# Altium schematic sheet panel_board.SchDoc
size A4
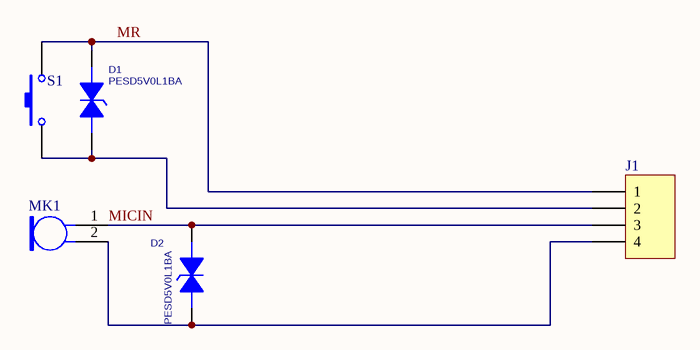
[diagram p0: panel_board.SchDoc]

## Parts
D1  PESD5V0L1BA  [SOD323]
D2  PESD5V0L1BA  [SOD323]
J1  MIC & RST-PB  [FPC1.0-DR-SMD-4P-F2.0]  (value not drawn)
MK1  Mic2  [MIC4015]  (value not drawn)
S1  SW-PB  [SW-PB-SMD]  (value not drawn)

## Nets
MICIN: D2.2 J1.3 MK1.1
MR: D1.2 J1.1 S1.1
NetD1_1: D1.1 J1.2 S1.2
NetD2_1: D2.1 J1.4 MK1.2

## Library data of the parts
D1 D2 = PESD
J1 = Header 4: Header, 4-Pin; LatestRevisionDate: 17-Jul-2002; LatestRevisionNote: Re-released for DXP Platform.; Publisher: Altium Limited
MK1 = Mic2: Microphone; Published: 24-Mar-1999; LatestRevisionDate: 17-Jul-2002; LatestRevisionNote: Re-released for DXP Platform.; PackageReference: PIN2; Publisher: Altium Limited
S1 = SW-PB: Switch; Published: 24-Mar-1999; LatestRevisionDate: 17-Jul-2002; LatestRevisionNote: Re-released for DXP Platform.; PackageReference: SPST-2; Publisher: Altium Limited; PackageDescription: Switch; 2 Leads